# EAGLE schematic ear-o_board (EAGLE 8.4.3)
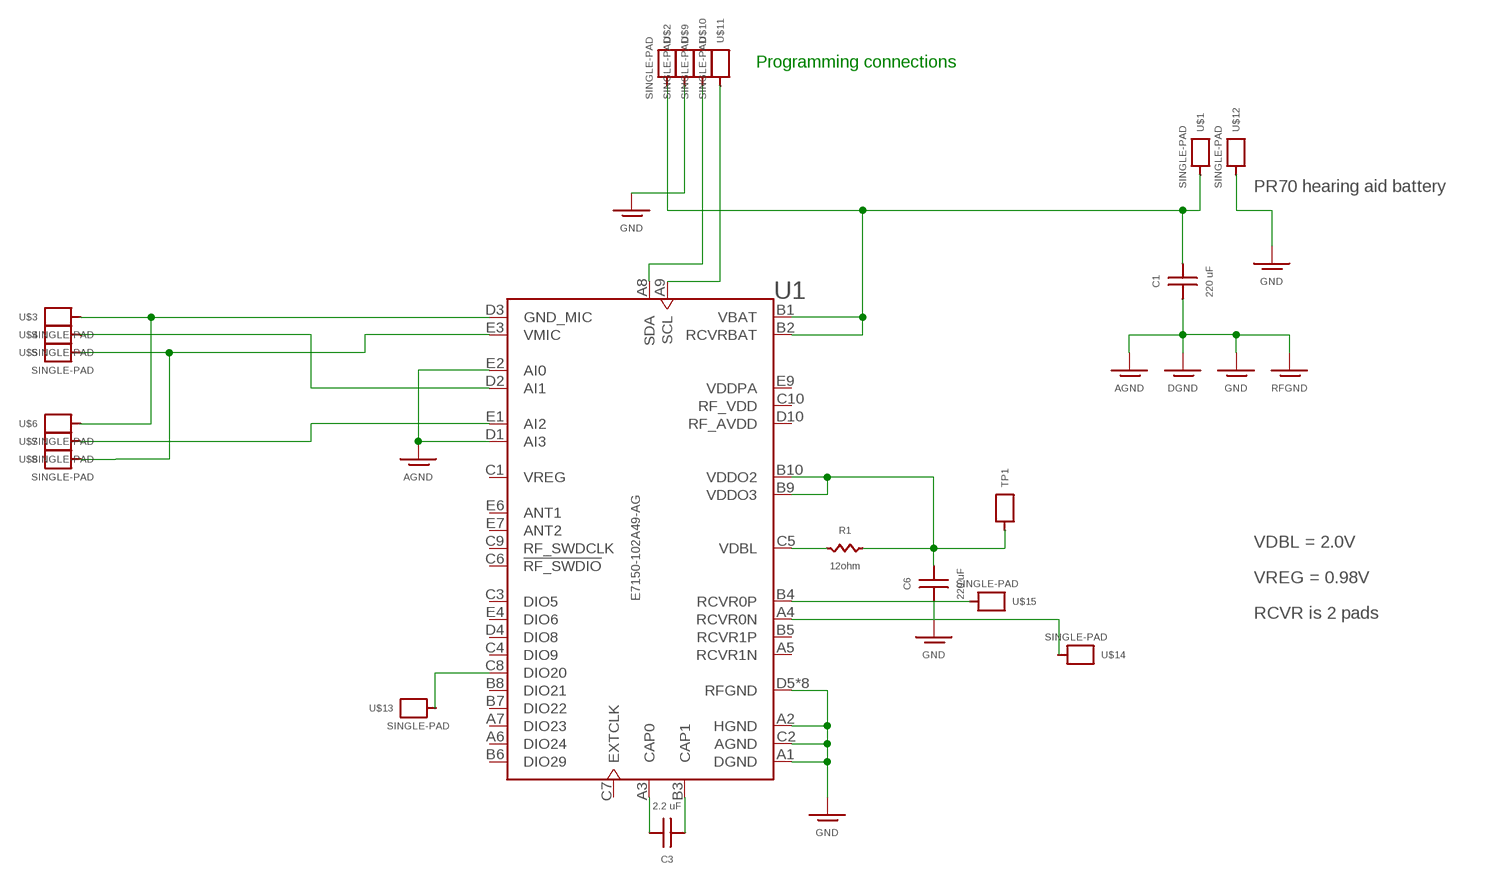
[diagram p0: schematic, sheet 1]

## Parts
C1  220 uF  C220UF  [1206]
C3  2.2 uF  C2.2UF  [0201]
C6  220 uF  C220UF  [1206]
R1  12ohm  R12OHM  [0201]
TP1  TEST-POINT  [TEST-PAD-0.2]
U1  E7150-102A49-AG  [BGA49C69P10X5_739X394X178]
U$1  SINGLE-PAD  [SINGLE-PAD]
U$2  SINGLE-PAD  [SINGLE-PAD]
U$3  SINGLE-PAD  [SINGLE-PAD]
U$4  SINGLE-PAD  [SINGLE-PAD]
U$5  SINGLE-PAD  [SINGLE-PAD]
U$6  SINGLE-PAD  [SINGLE-PAD]
U$7  SINGLE-PAD  [SINGLE-PAD]
U$8  SINGLE-PAD  [SINGLE-PAD]
U$9  SINGLE-PAD  [SINGLE-PAD]
U$10  SINGLE-PAD  [SINGLE-PAD]
U$11  SINGLE-PAD  [SINGLE-PAD]
U$12  SINGLE-PAD  [SINGLE-PAD]
U$13  SINGLE-PAD  [SINGLE-PAD]
U$14  SINGLE-PAD  [SINGLE-PAD]
U$15  SINGLE-PAD  [SINGLE-PAD]

## Nets
1.4V: C1.P$2 U1.B1(VBAT) U1.B2(RCVRBAT) U$1.P$1 U$2.P$1
GND: C1.P$1 C6.P$1 U1.A1(DGND) U1.A2(HGND) U1.C2(AGND) U1.D1(AI3) U1.D5(RFGND) U1.D6(RFGND) U1.D7(RFGND) U1.D8(RFGND) U1.D9(RFGND) U1.E2(AI0) U1.E5(RFGND) U1.E8(RFGND) U1.E10(RFGND) U$9.P$1 U$12.P$1 ; supply symbol labelled DGND, AGND, RFGND
MIC1S: U1.D2(AI1) U$4.P$1
MIC2S: U1.E1(AI2) U$7.P$1
MIC-N: U1.D3(GND_MIC) U$3.P$1 U$6.P$1
MIC-P: U1.E3(VMIC) U$5.P$1 U$8.P$1
N$1: U1.C8(DIO20) U$13.P$1
N$3: R1.P$1 U1.C5(VDBL)
N$10: C3.P$2 U1.A3(CAP0)
N$13: C3.P$1 U1.B3(CAP1)
RCVR0N: U1.A4(RCVR0N) U$14.P$1
RCVR0P: U1.B4(RCVR0P) U$15.P$1
SCL: U1.A9(SCL) U$11.P$1
SDA: U1.A8(SDA) U$10.P$1
VDBL: C6.P$2 R1.P$2 TP1.P U1.B9(VDDO3) U1.B10(VDDO2)
Unconnected: U1.A5(RCVR1N) U1.A6(DIO24) U1.A7(DIO23) U1.B5(RCVR1P) U1.B6(DIO29) U1.B7(DIO22) U1.B8(DIO21) U1.C3(DIO5) U1.C4(DIO9) U1.C6(!RF_SWDIO) U1.C7(EXTCLK) U1.C9(RF_SWDCLK) U1.D4(DIO8) U1.E4(DIO6) U1.E6(ANT1) U1.E7(ANT2)

## Notes on the sheet
- Programming connections
- PR70 hearing aid battery
- VDBL = 2.0V
- VREG = 0.98V
- RCVR is 2 pads

## Power pins joined to a net without a drawn wire
RF_AVDD: U1.D10(RF_AVDD)
RF_VDD: U1.C10(RF_VDD)
VDDPA: U1.E9(VDDPA)
VREG: U1.C1(VREG)

## Library data of the parts
C1 C6 = my-parts-v1:C220UF: digikey pn 490-9774-2-ND package 1206
C3 = my-parts-v1:C2.2UF: digkey pn 490-13224-2-ND 0201 package
R1 = my-parts-v1:R12OHM: dgikey pn P12.0ABTR-ND
TP1 = my-parts-v1:TEST-POINT
U1 = E7150-102A49-AG:E7150-102A49-AG: Reel / Ezario 7150 Sl; MANUFACTURER: ON Semiconductor
U$1-U$15 = my-parts-v1:SINGLE-PAD